# EAGLE design 89c2051-kc85-ps2 (EAGLE 4.16)
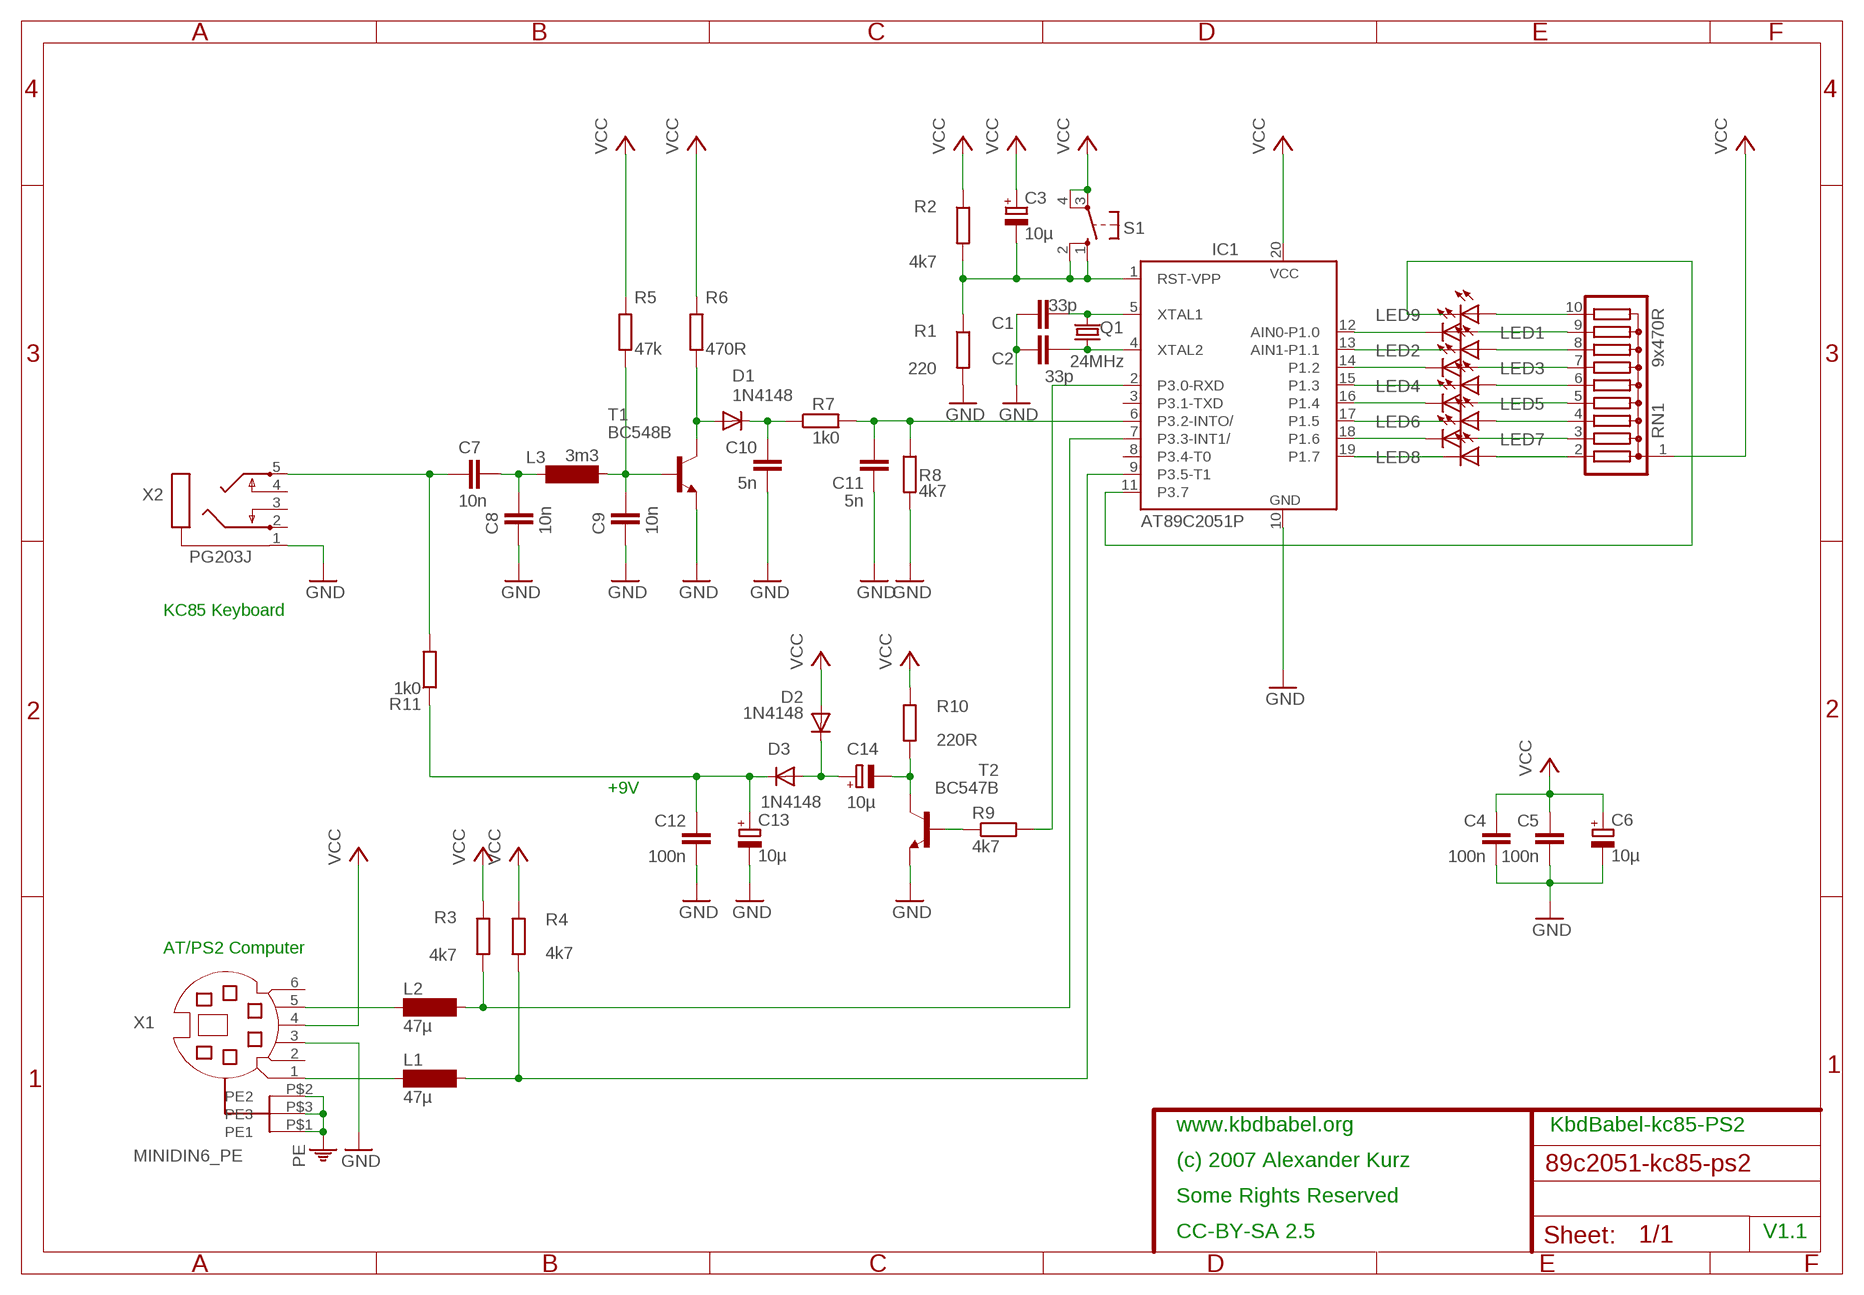
[diagram p0: schematic, sheet 1]

## Parts
C1  33p  C-EU025-024X044  [C025-024X044]
C2  33p  C-EU025-024X044  [C025-024X044]
C3  10µ  CPOL-EUE2-5  [E2-5]
C4  100n  C-EU025-025X050  [C025-025X050]
C5  100n  C-EU025-025X050  [C025-025X050]
C6  10µ  CPOL-EUE2-5  [E2-5]
C7  10n  C-EU025-025X050  [C025-025X050]
C8  10n  C-EU025-025X050  [C025-025X050]
C9  10n  C-EU025-025X050  [C025-025X050]
C10  5n  C-EU025-025X050  [C025-025X050]
C11  5n  C-EU025-025X050  [C025-025X050]
C12  100n  C-EU050-024X044  [C050-024X044]
C13  10µ  CPOL-EUE2-4  [E2-4]
C14  10µ  CPOL-EUE2-4  [E2-4]
D1  1N4148  [DO35-10]
D2  1N4148  [DO35-10]
D3  1N4148  [DO35-10]
IC1  AT89C2051P  [DIL20]
L1  47µ  SD75  [SD75]
L2  47µ  SD75  [SD75]
L3  3m3  SD75  [SD75]
LED1  LEDSQR2X5  [LED2X5]
LED2  LEDSQR2X5  [LED2X5]
LED3  LEDSQR2X5  [LED2X5]
LED4  LEDSQR2X5  [LED2X5]
LED5  LEDSQR2X5  [LED2X5]
LED6  LEDSQR2X5  [LED2X5]
LED7  LEDSQR2X5  [LED2X5]
LED8  LEDSQR2X5  [LED2X5]
LED9  LEDSQR2X5  [LED2X5]
Q1  24MHz  CRYSTALHC49U70  [HC49U70]
R1  220  R-EU_0204/7  [0204/7]
R2  4k7  R-EU_0204/5  [0204/5]
R3  4k7  R-EU_0204/5  [0204/5]
R4  4k7  R-EU_0204/5  [0204/5]
R5  47k  R-EU_0204/5  [0204/5]
R6  470R  R-EU_0204/5  [0204/5]
R7  1k0  R-EU_0204/5  [0204/5]
R8  4k7  R-EU_0204/5  [0204/5]
R9  4k7  R-EU_0204/5  [0204/5]
R10  220R  R-EU_0204/5  [0204/5]
R11  1k0  R-EU_0204/5  [0204/5]
RN1  9x470R  G09R  [SIL10]
S1  10-XX  [B3F-10XX]
T1  BC548B  [TO92-EBC]
T2  BC547B  [TO92]
X1  MINIDIN6_PE  [MINIDIN6_PE]
X2  PG203J  [PG203J]

## Nets
+9V: C12.1 C13.+ D3.C R11.1
GND: C1.1 C2.2 C4.2 C5.2 C6.- C8.2 C9.2 C10.2 C11.2 C12.2 C13.- IC1.10(GND) R1.2 R8.2 T1.E T2.1(E) X1.3 X2.1
N$1: C1.2 IC1.5(XTAL1) Q1.2
N$2: C2.1 IC1.4(XTAL2) Q1.1
N$4: IC1.12(AIN0-P1.0) LED1.K(C)
N$5: IC1.13(AIN1-P1.1) LED2.K(C)
N$6: L2.1 X1.5
N$7: C7.1 C8.1 L3.2
N$8: IC1.14(P1.2) LED3.K(C)
N$9: C3.- IC1.1(RST-VPP) R1.1 R2.2 S1.1(S) S1.2(S1)
N$10: D1.A R6.2 T1.C
N$11: IC1.15(P1.3) LED4.K(C)
N$12: IC1.9(P3.5-T1) L1.2 R4.2
N$13: IC1.16(P1.4) LED5.K(C)
N$14: IC1.17(P1.5) LED6.K(C)
N$15: IC1.18(P1.6) LED7.K(C)
N$16: IC1.19(P1.7) LED8.K(C)
N$17: LED8.A RN1.2
N$18: LED7.A RN1.3
N$19: LED6.A RN1.4
N$20: LED5.A RN1.5
N$21: LED4.A RN1.6
N$22: LED3.A RN1.7
N$23: LED2.A RN1.8
N$24: LED1.A RN1.9
N$25: LED9.A RN1.10
N$26: L1.1 X1.1
N$27: C7.2 R11.2 X2.5
N$28: IC1.11(P3.7) LED9.K(C)
N$29: IC1.2(P3.0-RXD) R9.2
N$30: IC1.7(P3.3-INT1/) L2.2 R3.2
N$31: C9.1 L3.1 R5.2 T1.B
N$32: C10.1 D1.C R7.1
N$33: C11.1 IC1.6(P3.2-INTO/) R7.2 R8.1
N$34: R9.1 T2.2(B)
N$35: C14.- R10.1 T2.3(C)
N$36: C14.+ D2.C D3.A
PE: X1.P$1(PE1) X1.P$2(PE2) X1.P$3(PE3)
VCC: C3.+ C4.1 C5.1 C6.+ D2.A IC1.20(VCC) R2.1 R3.1 R4.1 R5.1 R6.1 R10.2 RN1.1 S1.3(P) S1.4(P1) X1.4
Unconnected: IC1.3(P3.1-TXD) IC1.8(P3.4-T0) X1.2 X1.6 X2.2 X2.3 X2.4

## Notes on the sheet
- KC85 Keyboard
- +9V
- AT/PS2 Computer
- www.kbdbabel.org | KbdBabel-kc85-PS2
- (c) 2007 Alexander Kurz
- Some Rights Reserved
- CC-BY-SA 2.5 | V1.1

## Library data of the parts
C1 C2 C4 C5 C7-C12 = rcl:C-EU: CAPACITOR, European symbol
C3 C6 C13 C14 = rcl:CPOL-EU: POLARIZED CAPACITOR, European symbol
D1-D3 = diode:1N4148: DIODE high speed (Philips)
IC1 = atmel:AT89C2051: 80C31 MICROCONTROLLER 2 Kbytes FLASH 2.7 V
L1-L3 = inductor-neosid:SD75: INDUCTOR nominal inductance, E12
LED1-LED9 = led:LED: LED OSRAM: - CHIPLED LG R971, LG N971, LY N971, LG Q971, LY Q971, LO R971, LY R971 LH N974, LH R974 LS Q976, LO Q976, LY Q976 LO Q996 - Hyper CHIPLED LW Q18S LB Q993, LB Q99A, LB R99A - SideLED LS A670, LO A670, LY A670, LG A670, LP A670 LB A673, LV A673, LT A673, LW A673 LH A674 LY A675 LS A676, LA A676, LO A676, LY A676, LW A676 LS A679, LY A679, LG A679 - Hyper Micro SIDELED® LS Y876, LA Y876, LO Y876, LY Y876 LT Y87S - SmartLED LW L88C, LW L88S LB L89C, LB L89S, LG L890 LS L89K, LO L89K, LY L89K LS L896, LA L896, LO L896, LY L896 - TOPLED LS T670, LO T670, LY T670, LG T670, LP T670 LSG T670, LSP T670, LSY T670, LOP T670, LYG T670 LG T671, LOG T671, LSG T671 LB T673, LV T673, LT T673, LW T673 LH T674 LS T676, LA T676, LO T676, LY T676, LB T676, LH T676, LSB T676, LW T676 LB T67C, LV T67C, LT T67C, LS T67K, LO T67K, LY T67K, LW E67C LS E67B, LA E67B, LO E67B, LY E67B, LB E67C, LV E67C, LT E67C LW T67C LS T679, LY T679, LG T679 LS T770, LO T770, LY T770, LG T770, LP T770 LB T773, LV T773, LT T773, LW T773 LH T774 LS E675, LA E675, LY E675, LS T675 LS T776, LA T776, LO T776, LY T776, LB T776 LHGB T686 LT T68C, LB T68C - Hyper Mini TOPLED® LB M676 - Mini TOPLED Santana® LG M470 LS M47K, LO M47K, LY M47K Source: http://www.osram.convergy.de - LUMILED® LXK2-PW12-R00, LXK2-PW12-S00, LXK2-PW14-U00, LXK2-PW14-V00 LXK2-PM12-R00, LXK2-PM12-S00, LXK2-PM14-U00 LXK2-PE12-Q00, LXK2-PE12-R00, LXK2-PE12-S00, LXK2-PE14-T00, LXK2-PE14-U00 LXK2-PB12-K00, LXK2-PB12-L00, LXK2-PB12-M00, LXK2-PB14-N00, LXK2-PB14-P00, LXK2-PB14-Q00 LXK2-PR12-L00, LXK2-PR12-M00, LXK2-PR14-Q00, LXK2-PR14-R00 LXK2-PD12-Q00, LXK2-PD12-R00, LXK2-PD12-S00 LXK2-PH12-R00, LXK2-PH12-S00 LXK2-PL12-P00, LXK2-PL12-Q00, LXK2-PL12-R00 Source: www.luxeon.com
Q1 = crystal:CRYSTAL: CRYSTAL
R1-R11 = rcl:R-EU_: RESISTOR, European symbol
RN1 = resistor-sil:G09R: SIL RESISTOR
S1 = switch-omron:10-XX: OMRON SWITCH
T1 = transistor-npn:BC548*: NPN Transistor
T2 = transistor-npn:BC547*: NPN Transistor
X1 = bla:MINIDIN6_PE
X2 = con-hirschmann:PG203J: MIC/HEADPHONE JACK KS-S stereo microphone/headphone jack PG203JN (Schukat)

## Board
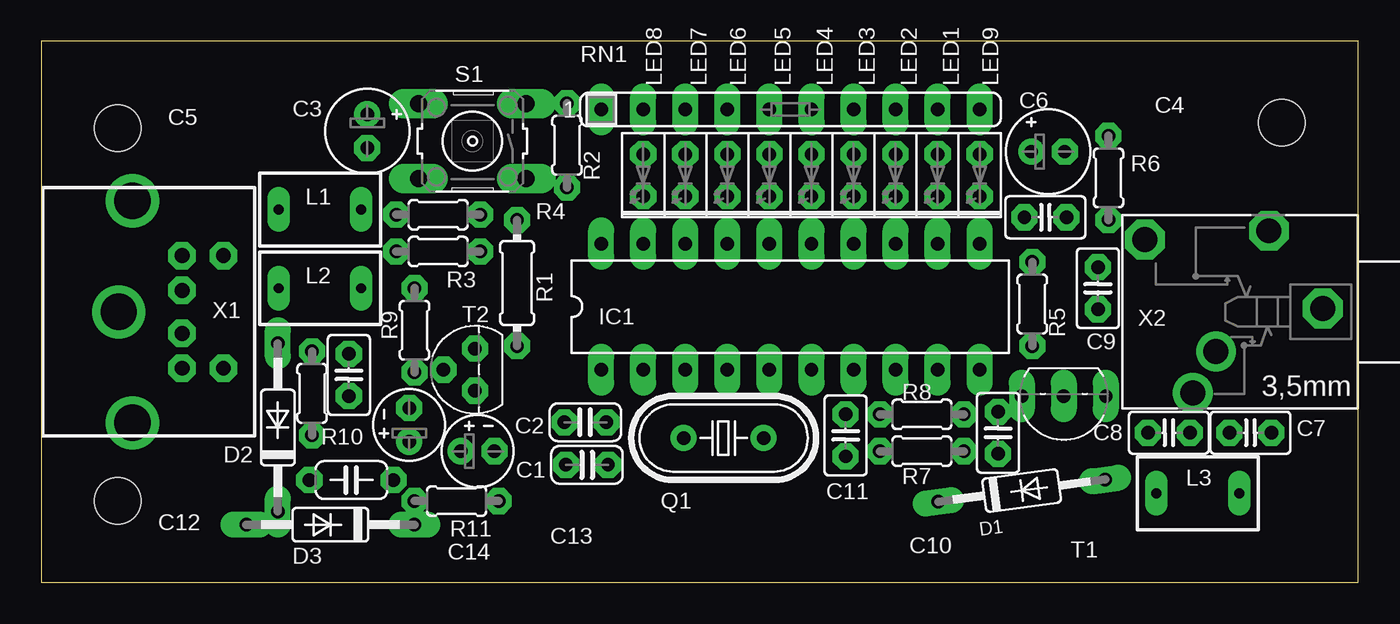
[diagram p1: board, top side]
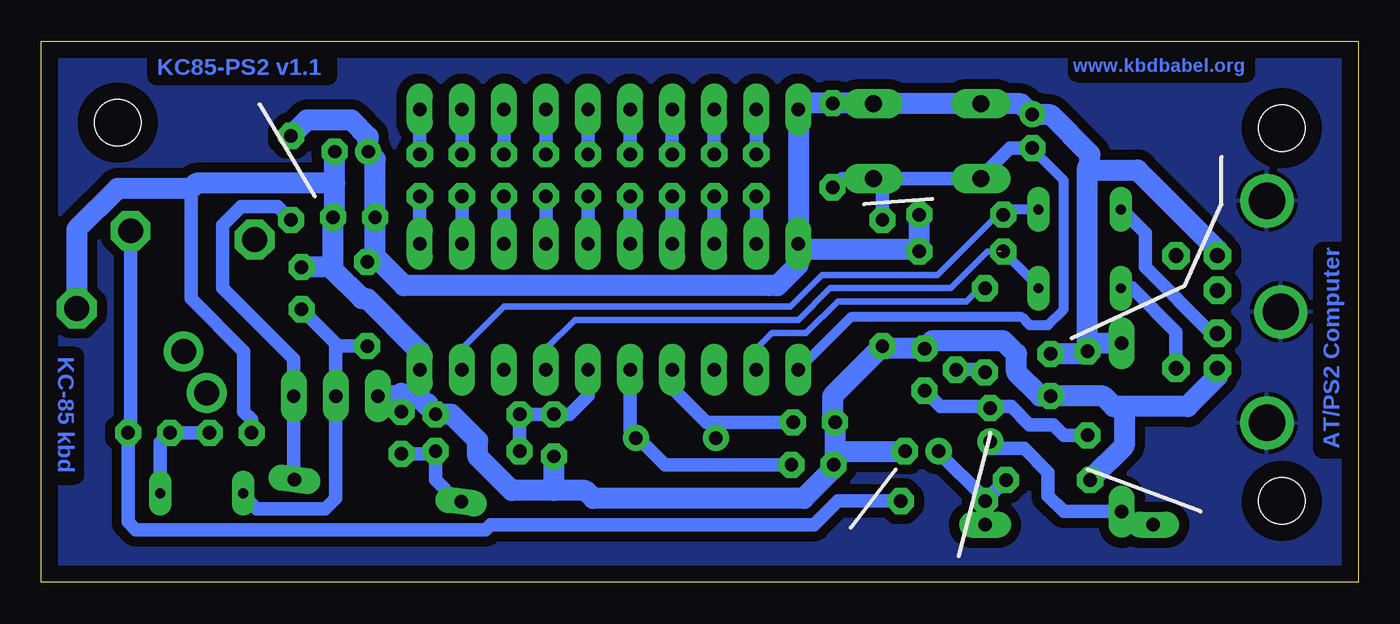
[diagram p2: board, bottom side, seen from below]

Size 79.52 x 32.69 mm. Coordinates in mm from the lower left corner, seen from the top.
Outline: 79.52,0 79.52,32.69 0,32.69 0,0 79.52,0
Copper layers (1*16): Top 0.035mm / dielectric 1.5mm / Bottom 0.035mm
Design rules "default": minimum track width 16mil, minimum drill 24mil, track to track 12mil, track to pad 12mil, pad to pad 12mil, via to via 16mil, smd to smd 16mil, copper to edge 40mil, drill to drill 8mil, minimum pad ring 15mil, minimum via ring 8mil, stop-mask expansion 4mil, vias tented up to drill 0mil, thermal gap 10mil
Holes 2.8 mm at 74.92,27.78 4.6,27.46 4.6,4.91

### Footprints (pad centres in the part's own frame; a part is rotated, then mirrored left to right if it is on the bottom)
C025-024X044 = drill 0.813 octagon: 1 -1.27,0; 2 1.27,0
E2-5 = drill 0.813 pad 1.27 round: + -1.016,0 | drill 0.813 pad 1.27 octagon: - 1.016,0
C025-025X050 = drill 0.813 octagon: 1 -1.27,0; 2 1.27,0
C050-024X044 = drill 0.813 octagon: 1 -2.54,0; 2 2.54,0
E2-4 = drill 0.813 pad 1.27 round: + -1.016,0 | drill 0.813 pad 1.27 octagon: - 1.016,0
DO35-10 = drill 0.813 long: A 5.08,0; C -5.08,0
DIL20 = drill 0.813 long: 1 -11.43,-3.81; 2 -8.89,-3.81; 3 -6.35,-3.81; 4 -3.81,-3.81; 5 -1.27,-3.81; 6 1.27,-3.81; 7 3.81,-3.81; 8 6.35,-3.81; 9 8.89,-3.81; 10 11.43,-3.81; 11 11.43,3.81; 12 8.89,3.81; 13 6.35,3.81; 14 3.81,3.81; 15 1.27,3.81; 16 -1.27,3.81; 17 -3.81,3.81; 18 -6.35,3.81; 19 -8.89,3.81; 20 -11.43,3.81
SD75 = drill 0.6 long: 1 -2.5,0; 2 2.5,0
LED2X5 = drill 0.813 octagon: A -1.27,0; K 1.27,0
HC49U70 = drill 0.813 round: 1 -2.413,0; 2 2.413,0
0204/7 = drill 0.813 octagon: 1 -3.81,0; 2 3.81,0
0204/5 = drill 0.813 octagon: 1 -2.54,0; 2 2.54,0
SIL10 = drill 0.813 long: 1 -11.43,0; 2 -8.89,0; 3 -6.35,0; 4 -3.81,0; 5 -1.27,0; 6 1.27,0; 7 3.81,0; 8 6.35,0; 9 8.89,0; 10 11.43,0
B3F-10XX = drill 1.016 long: 1 -3.251,2.261; 2 3.251,2.261; 3 -3.251,-2.261; 4 3.251,-2.261
TO92-EBC = drill 0.813 long: B 0,-1.27; C -2.54,-1.27; E 2.54,-1.27
TO92 = drill 0.813 octagon: 1 1.27,0; 2 0,1.905; 3 -1.27,0
MINIDIN6_PE = drill 0.9 octagon: 1 1.3,2.15; 2 -1.3,2.15; 3 3.4,2.15; 4 -3.4,2.15; 5 3.4,4.65; 6 -3.4,4.65 | drill 2.2 round: P$1 0,-1.676; P$2 -6.706,-0.838; P$3 6.706,-0.838
PG203J = drill 1.499 octagon: 1 -5.004,-0.203; 4 5.74,-4.369; 5 -1.753,-4.902 | drill 1.499 round: 2 2.845,4.902; 3 1.448,2.388

### Placement (x,y rotation side)
C1  32.95,7.11 0 top
C2  32.86,9.68 180 top
C3  19.68,27.27 270 top
C4  60.64,22.06 0 top
C5  18.57,12.53 270 top
C6  60.8,26.03 0 top
C7  73.02,9.04 0 top
C8  68.1,9.04 180 top
C9  63.81,17.77 90 top
C10  57.78,9.04 90 top
C11  48.57,8.88 270 top
C12  18.73,6.18 180 top
C13  26.35,7.93 0 top
C14  22.22,9.52 90 top
D1  59.21,5.55 7.6 top
D2  14.28,9.36 90 top
D3  17.46,3.49 180 top
IC1  45.24,16.66 0 top
L1  16.82,22.54 0 top
L2  16.82,17.77 0 top
L3  69.84,5.39 0 top
LED1  54.13,24.6 270 top
LED2  51.59,24.6 270 top
LED3  49.05,24.6 270 top
LED4  46.51,24.6 270 top
LED5  43.97,24.6 270 top
LED6  41.43,24.6 270 top
LED7  38.89,24.6 270 top
LED8  36.35,24.6 270 top
LED9  56.67,24.6 270 top
Q1  41.21,8.72 0 top
R1  28.73,18.09 270 top
R2  31.74,26.41 270 top
R3  23.97,20 180 top
R4  23.97,22.22 180 top
R5  59.84,16.82 270 top
R6  64.45,24.44 270 top
R7  53.18,7.93 180 top
R8  53.18,10.15 0 top
R9  22.54,15.23 90 top
R10  16.35,11.42 90 top
R11  25.08,4.91 0 top
RN1  45.24,28.57 0 top
S1  26.03,26.66 180 top
T1  61.75,9.99 180 top
T2  26.19,12.85 90 top
X1  6.34,16.34 270 top
X2  72.39,16.34 180 top

### Tracks (layer width: path | path; a pad name or v marks a point on that pad's centre or on a via)
+9V
  Bottom 0.813: R11.1 C12.1 | R11.1 | R11.1 D3.C | 25.39,7.93 | 25.39,7.93 C13.+ | R11.1 22.54,5.07 25.39,7.93
GND
  Bottom 0.813: C8.2 66.83,9.84 67.3,10.31 67.3,13.96 70.48,17.14 70.48,23.81
  Bottom 1.27: X2.1 77.39,21.34 74.92,23.81 70.48,23.81 | 61.91,18.88 60.16,17.14 59.84,17.14 56.67,13.96 IC1.10 56.67,11.26 | 61.91,18.88 62.07,19.04 C9.2 | R8.2 | 56.67,11.26 56.67,11.11 56.27,10.71 | R8.2 56.27,10.71 | R8.2 54.76,10.15 53.18,8.57 53.18,7.61 51.11,5.55 48.57,5.55 | 56.27,10.71 56.19,10.79 | 56.67,11.26 57.78,11.26 | 57.78,11.26 T1.E | 57.78,11.26 57.78,11.42 | 57.78,11.42 C10.2 | 57.78,11.42 | X1.3 8.49,12.45 10.31,10.63 14.12,10.63 | 14.12,10.63 14.76,10.63 15.39,11.26 C5.2 | C5.2 | C5.2 | C5.2 19.2,11.26 20.63,12.69 20.63,13.8 | R1.2 | R1.2 31.74,11.26 31.74,9.99 C2.2 31.59,7.93 | C12.2 | C12.2 14.12,8.25 14.12,10.63 | 31.59,7.93 31.59,7.3 31.74,7.14 31.71,7.11 C1.1 31.68,6.88 33.49,5.07 46.19,5.07 46.67,5.55 48.57,5.55 | 31.59,7.93 | C13.- 31.59,7.93 | 48.57,5.55 | 48.57,5.55 C11.2 | 48.57,5.55 | 70.48,23.81 | 70.48,23.81 70.16,24.12 61.81,24.12 | C4.2 | 61.81,24.12 61.81,22.16 C4.2 | 61.81,24.12 C6.- | 61.91,18.88 | 61.91,18.88 C4.2 | 61.91,18.88 | T2.1 | R1.2 | R1.2 | T2.1 28.57,14.12 R1.2 | T2.1 25.71,14.6 21.43,14.6 20.63,13.8 | 20.63,13.8
N$1
  Bottom 0.813: IC1.5 43.97,9.2 43.49,8.72 | 43.49,8.72 Q1.2 | C1.2 41.87,7.11 43.49,8.72
N$2
  Bottom 0.813: IC1.4 41.43,11.74 39.36,9.68 38.89,9.68 | C2.1 38.89,9.68 | Q1.1 38.79,9.58 38.89,9.68
N$4
  Bottom 0.813: IC1.12 LED1.K
N$5
  Bottom 0.813: IC1.13 LED2.K
N$6
  Bottom 0.813: X1.5 10.99,15.12 13.65,17.77 14.28,17.77 L2.1
N$7
  Bottom 0.813: C7.1 71.91,9.04 71.87,9 | C8.1 C7.1 | C7.1 | L3.2 72.34,8.45 C7.1
N$8
  Bottom 0.813: IC1.14 LED3.K
N$9
  Bottom 0.61: C3.- 19.68,26.19 17.77,24.28 17.77,16.5 18.73,15.55 19.84,15.55 20.31,16.03 30.63,16.03 IC1.1
  Bottom 0.813: C3.- 21.04,26.25 22.85,24.44 22.82,24.4 S1.2 28.73,24.4 | 28.73,24.4 S1.1 | S1.1 29.33,24.4 29.36,24.44 | R2.2 31.74,23.81 31.15,24.4 S1.1 | 28.73,24.4 28.73,24.44 R1.1
N$10
  Bottom 0.813: D1.A 64.29,6.18 T1.C 64.29,13.49 68.57,17.77 68.57,21.58 67.46,22.69 65.24,22.69 R6.2
N$11
  Bottom 0.813: LED4.K 46.51,23.49 | LED4.K | IC1.15 LED4.K
N$12
  Bottom 0.406: 21.27,22.22 | R4.2 21.27,22.22 | R4.2 21.27,22.22 | 54.13,14.12 51.59,16.66 34.28,16.66 32.38,18.57 25.39,18.57 21.74,22.22 R4.2
  Bottom 0.61: L1.2 21.11,22.54 R4.2 | R4.2 | 54.13,14.12 IC1.9
N$13
  Bottom 0.813: IC1.16 LED5.K
N$14
  Bottom 0.813: IC1.17 LED6.K
N$15
  Bottom 0.813: IC1.18 LED7.K
N$16
  Bottom 0.813: IC1.19 LED8.K
N$17
  Bottom 0.813: LED8.A | LED8.A RN1.2
N$18
  Bottom 0.813: LED7.A | LED7.A RN1.3
N$19
  Bottom 0.813: LED6.A | LED6.A RN1.4
N$20
  Bottom 0.813: LED5.A RN1.5
N$21
  Bottom 0.813: LED4.A | LED4.A RN1.6
N$22
  Bottom 0.813: LED3.A RN1.7
N$23
  Bottom 0.813: LED2.A RN1.8
N$24
  Bottom 0.813: LED1.A RN1.9
N$25
  Bottom 0.813: LED9.A RN1.10
N$26
  Bottom 0.813: X1.1 8.85,15.04 12.85,19.04 12.85,21.11 14.28,22.54 L1.1
N$27
  Bottom 0.813: X2.5 74.14,9.35 74.45,9.04 C7.2 74.29,8.88 | 74.29,8.88 | 74.29,8.88 74.29,3.64 73.81,3.17 52.7,3.17 52.38,3.49 32.86,3.49 31.43,4.91 R11.2
N$28
  Bottom 0.813: IC1.11 | IC1.11 LED9.K
N$29
  Bottom 0.406: 36.35,14.12 35.4,15.07 33.33,15.07 31.43,16.98 23.65,16.98 22.85,17.77 | 22.85,17.77 | R9.2 22.85,17.77
  Bottom 0.61: 36.35,14.12 IC1.2
N$30  (1 unrouted)
  Bottom 0.406: 21.58,20 R3.2 | 21.74,20 | 49.05,14.12 47.3,15.87 33.81,15.87 31.9,17.77 24.6,17.77 22.38,20 R3.2
  Bottom 0.61: R3.2 19.32,17.89 L2.2 | 49.05,12.69 IC1.7 49.05,14.12
N$31
  Bottom 0.813: C9.1 61.75,14.44 61.75,14.12 | 61.75,14.12 T1.B 61.75,5.07 62.38,4.44 66.51,4.44 67.46,5.39 L3.1 | R5.2 61.59,14.28 61.75,14.12
N$32
  Bottom 0.813: R7.1 55.87,7.93 56.03,7.77 C10.1 | D1.C 54.41,4.88 55.72,6.18 R7.1 | R7.1
N$33
  Bottom 0.813: R7.2 R8.1 | IC1.6 46.51,11.26 47.62,10.15 C11.1 | C11.1 | C11.1 | R8.1 | R8.1 C11.1 | R8.1
N$34
  Bottom 0.813: T2.2 | R9.1 | T2.2 22.7,12.85 R9.1
N$35
  Bottom 0.813: R10.1 17.77,8.88 18.41,9.52 19.84,9.52 20.95,10.63 22.22,10.63 | 22.22,10.63 25.24,10.63 T2.3 | 22.22,10.63 22.22,10.47 C14.-
N$36
  Bottom 0.813: D2.C | D3.A 13.49,3.49 D2.C | D2.C 17.77,4.28 18.73,5.23 18.73,6.66 20.16,8.09 21.9,8.09 22.31,8.5 | 22.31,8.5 22.38,8.57 | 22.31,8.5 C14.+
PE
  pour Bottom (isolate 0.61): 79.52,-0.13 79.64,32.85 -0.18,32.85 -0.14,-0.1
VCC
  Bottom 1.27: 57.62,17.93 57.6,17.91 | 57.62,17.93 59.37,19.68 | 59.37,19.68 59.37,21.9 C4.1 59.37,25.55 59.84,26.03 | 59.84,26.03 | 59.84,26.03 C6.+ 59.78,26.92 60.8,27.93 63.49,27.93 R6.1 | 33.81,28.41 IC1.20 | 19.68,28.25 | 19.68,28.25 C3.+ | 19.68,28.25 20.35,28.92 S1.4 22.82,28.92 22.85,28.89 22.89,28.92 S1.3 29.33,28.92 29.36,28.89 29.43,28.95 31.65,28.95 31.74,29.04 R2.1 33.27,28.95 33.81,28.41 | 19.68,28.25 18.57,28.25 16.19,25.87 16.19,25.08 | 16.19,25.08 16.19,24.92 13.33,24.92 8.49,20.08 X1.4 | 57.62,17.93 | 35.55,17.93 57.62,17.93 | 33.81,28.41 RN1.1 | 26.51,20.15 R3.1 | 26.51,20.15 33.81,20.15 IC1.20 | R4.1 | 26.51,20.15 R4.1 | R4.1 | 16.19,25.08 16.35,25.08 16.35,14.44 | 16.35,14.44 R10.2 | D2.A 16.35,14.44 | 16.35,14.44 | R10.2 | C5.1 16.5,13.8 R10.2 | 35.55,17.93 | R5.1 | R5.1 | 59.37,19.68 59.53,19.68 R5.1 | 35.55,17.93 35.08,17.93 33.81,19.2 33.81,20.31 33.97,20.47 IC1.20

### Text on the board
Bottom: www.kbdbabel.org | KC85-PS2 v1.1 | KC-85 kbd | AT/PS2 Computer